# EAGLE schematic RefOsc10MHz_3V0_bga-escaped (EAGLE 7.2.0), part 2 of 2
## Sheet 25 of 27: Socket_3
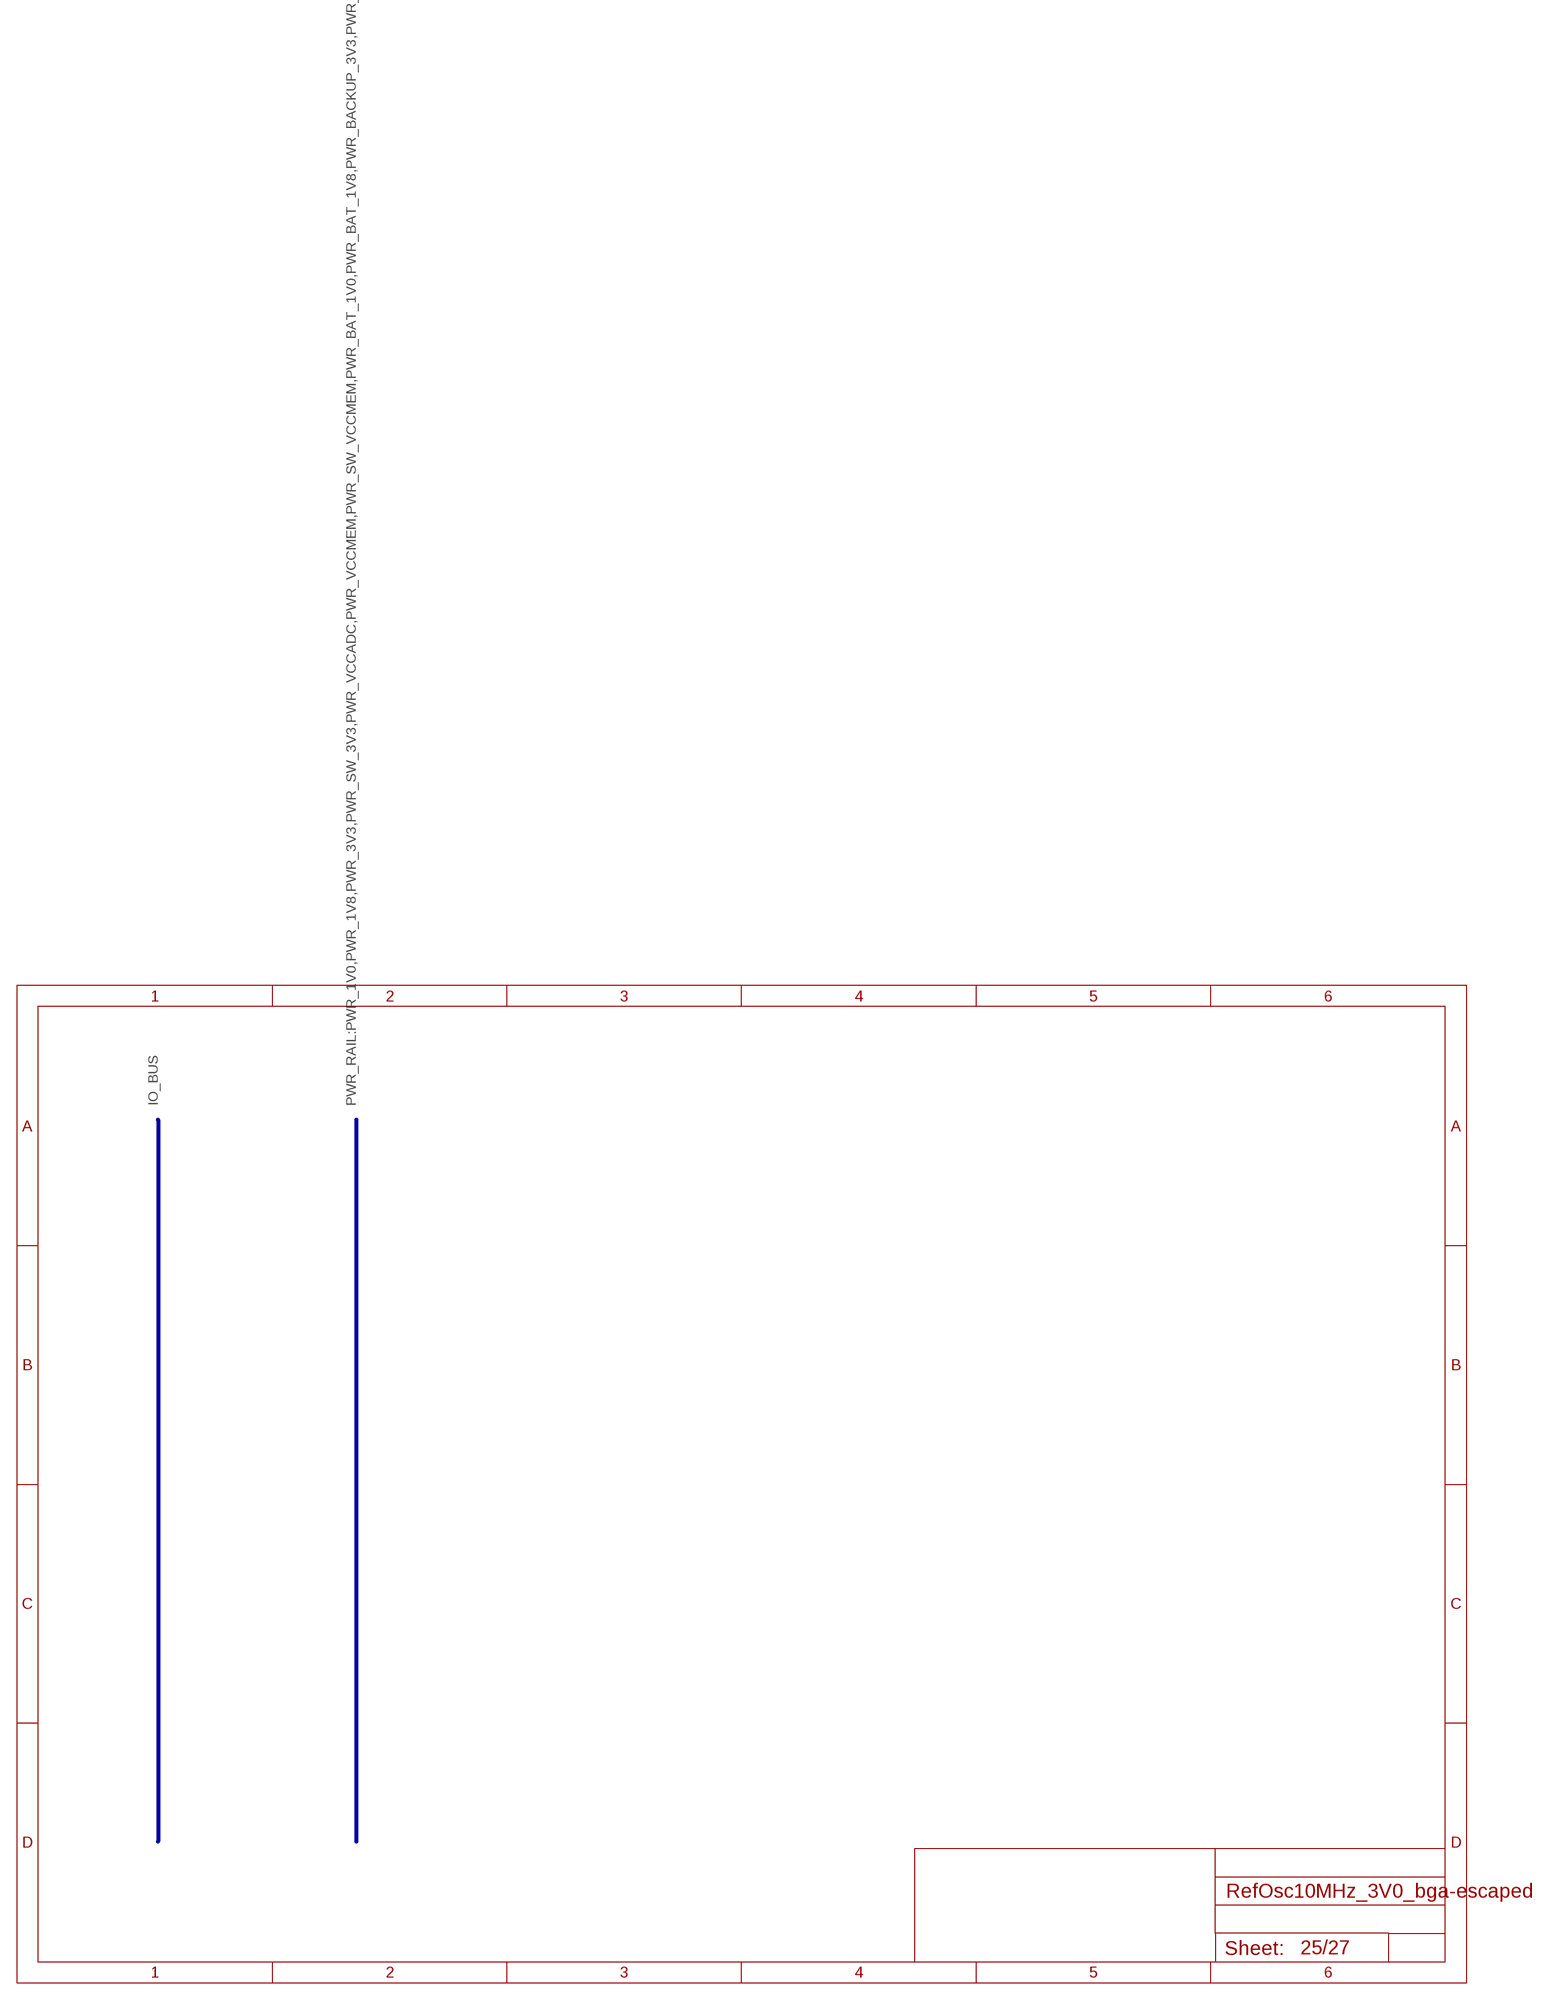
[diagram p24: schematic, sheet 25]

### Buses
IO_BUS
PWR_RAIL:PWR_1V0,PWR_1V8,PWR_3V3,PWR_SW_3V3,PWR_VCCADC,PWR_VCCMEM,PWR_SW_VCCMEM,PWR_BAT_1V0,PWR_BAT_1V8,PWR_BACKUP_3V3,PWR_5V0,PWR_SW_5V0,GND

## Sheet 26 of 27: Socket_4
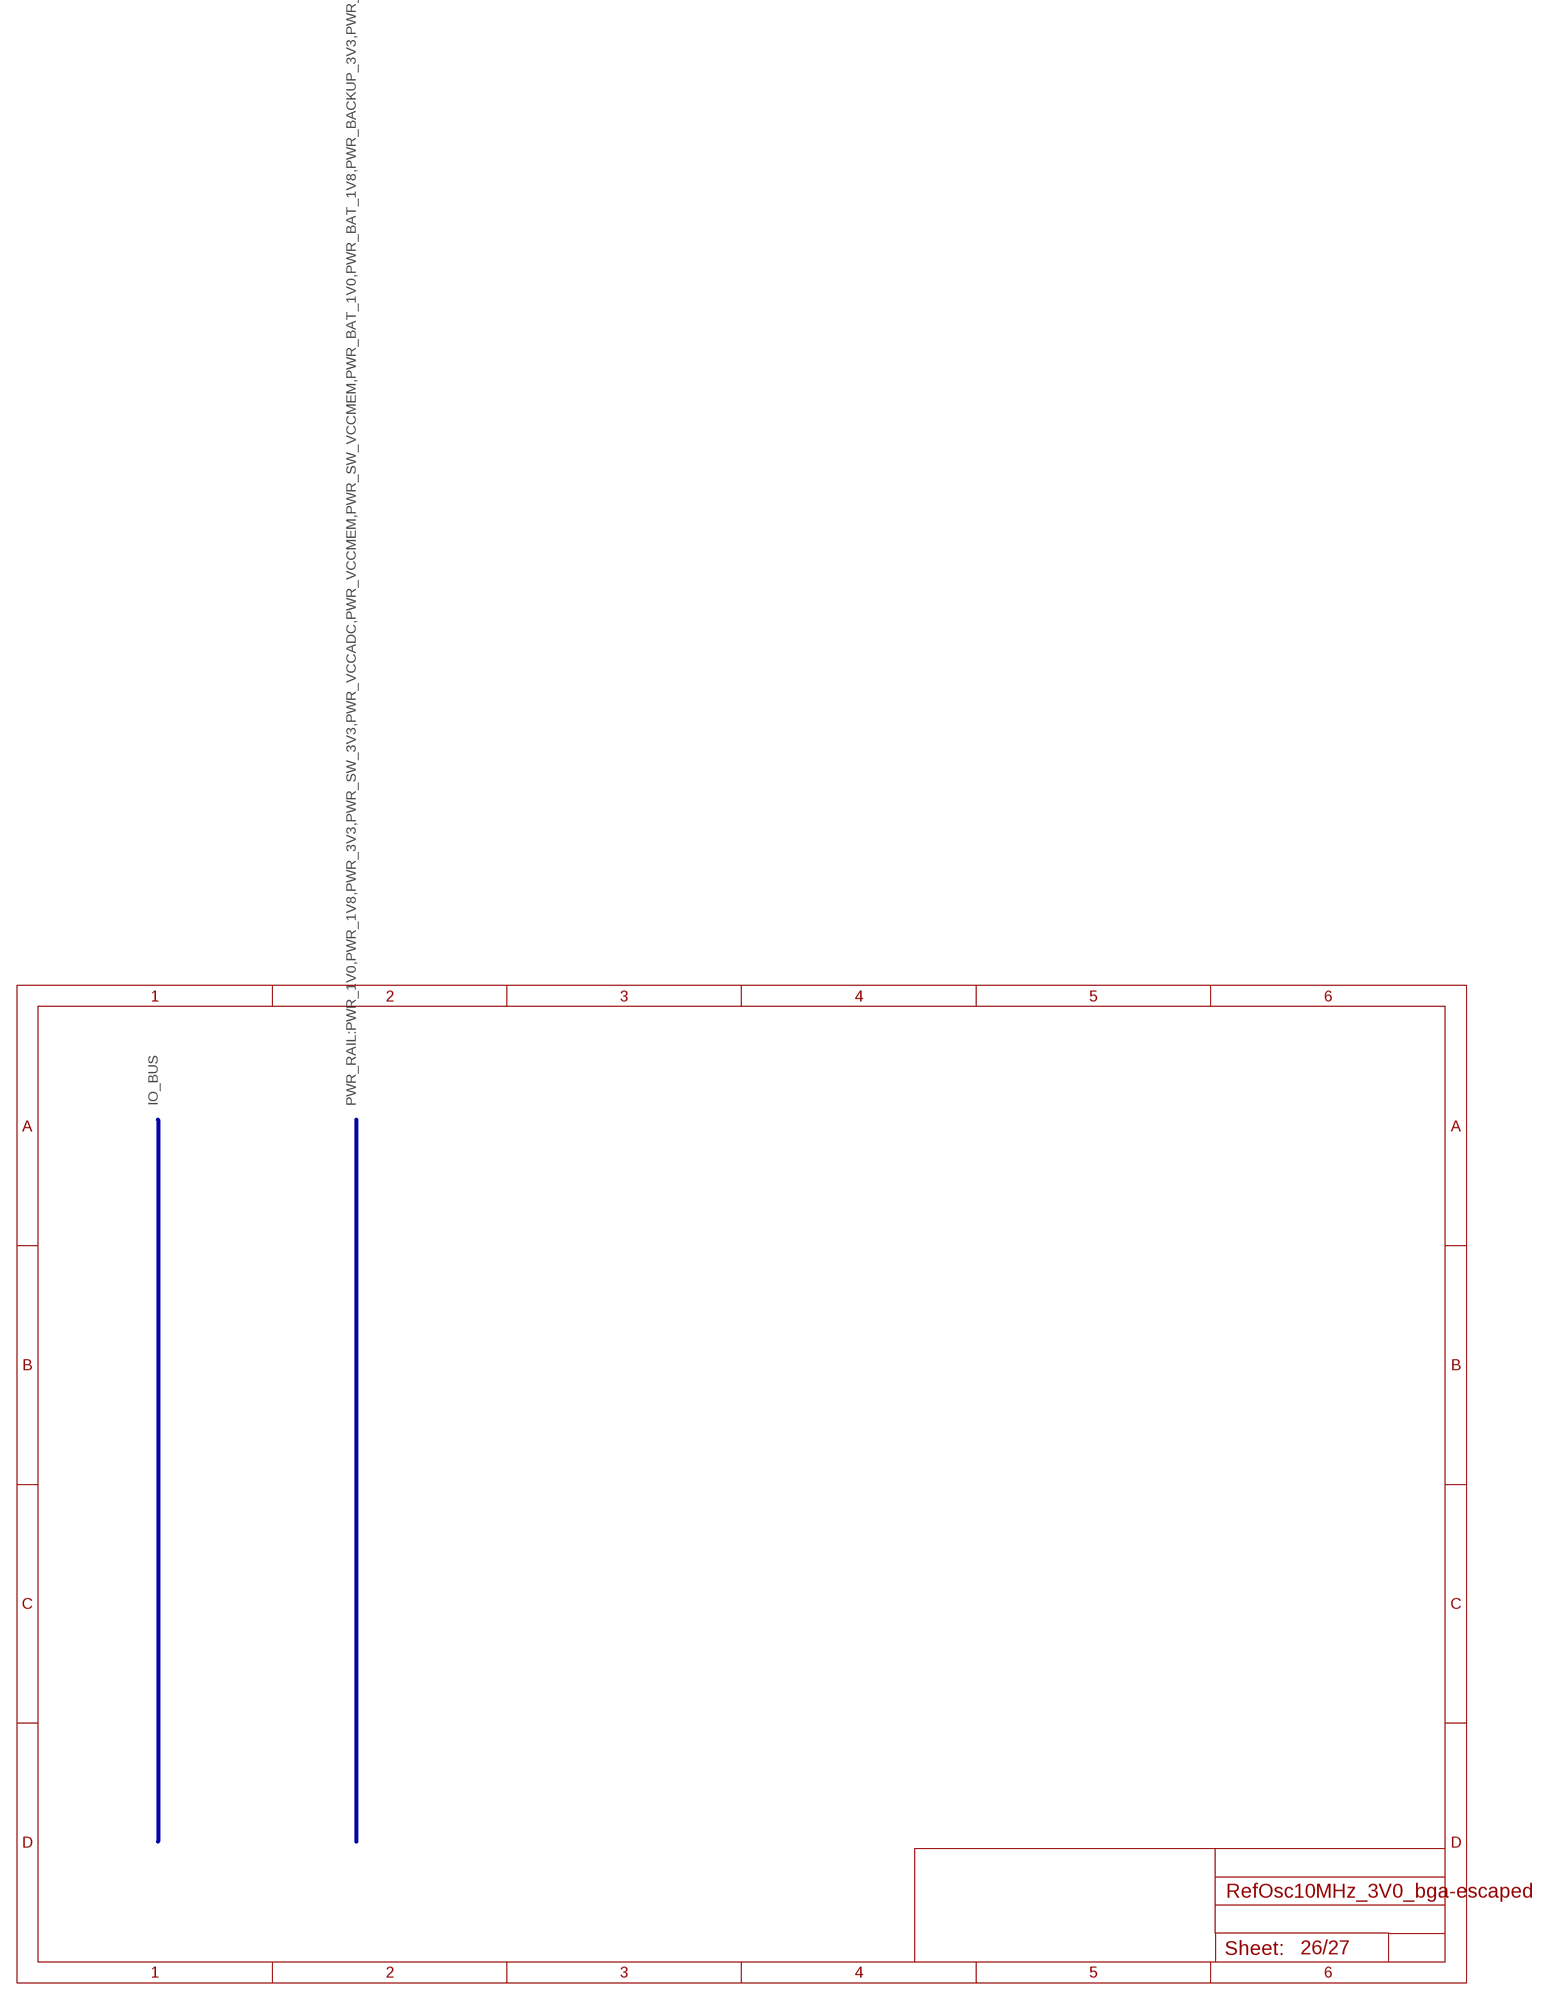
[diagram p25: schematic, sheet 26]

### Buses
IO_BUS
PWR_RAIL:PWR_1V0,PWR_1V8,PWR_3V3,PWR_SW_3V3,PWR_VCCADC,PWR_VCCMEM,PWR_SW_VCCMEM,PWR_BAT_1V0,PWR_BAT_1V8,PWR_BACKUP_3V3,PWR_5V0,PWR_SW_5V0,GND

## Sheet 27 of 27: Socket_5
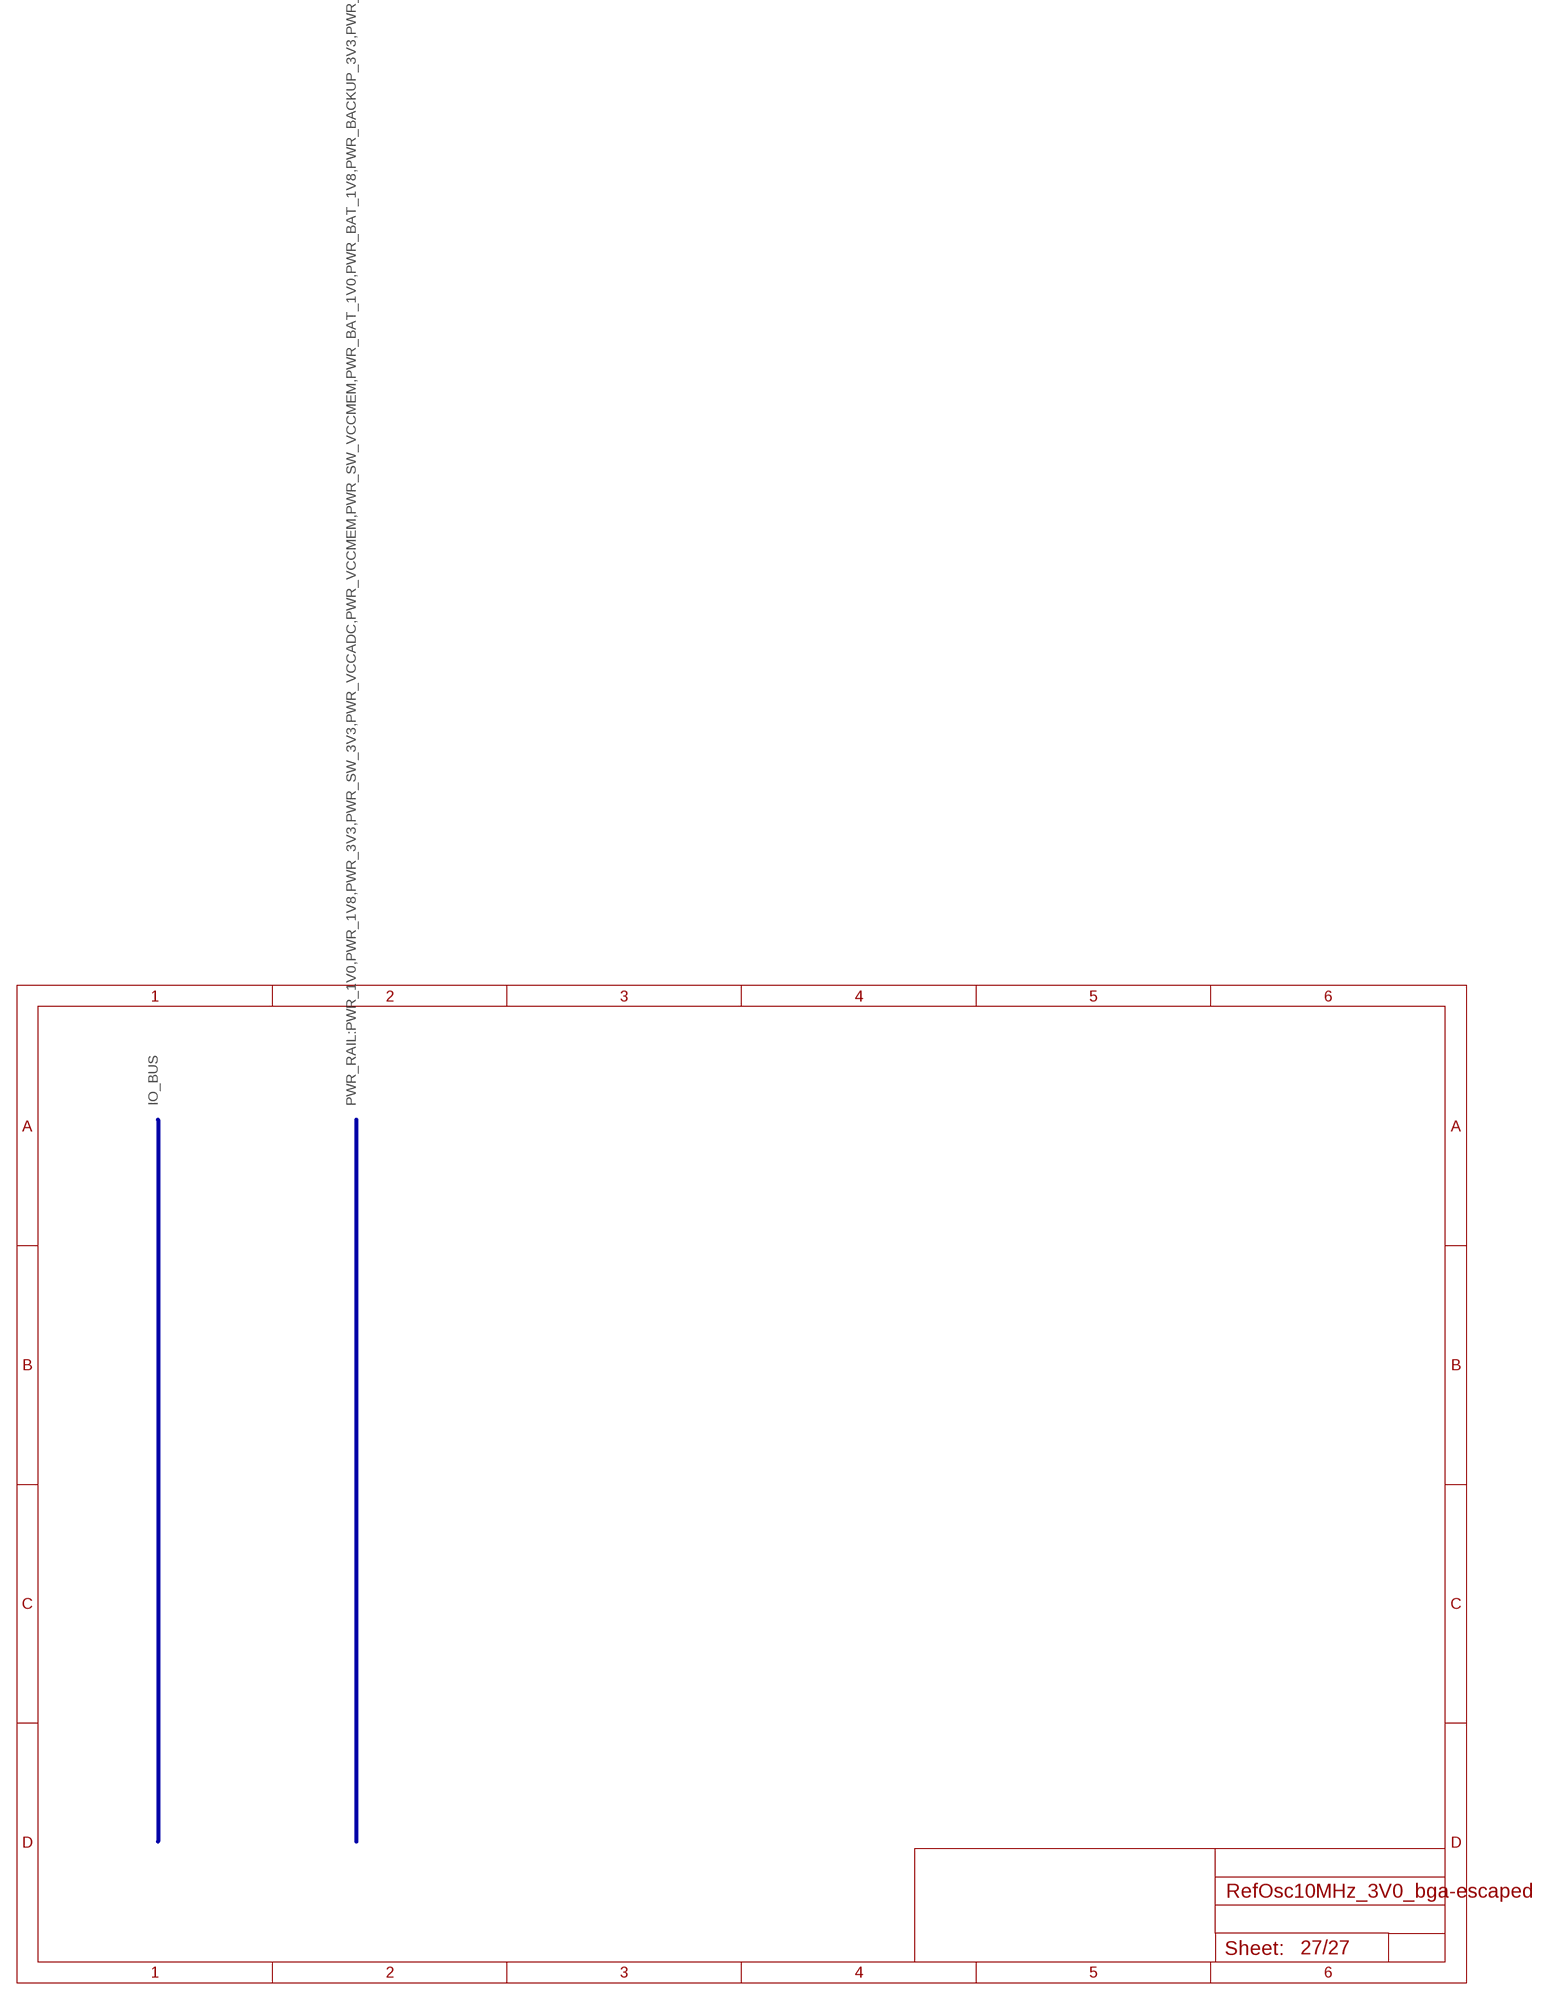
[diagram p26: schematic, sheet 27]

### Buses
IO_BUS
PWR_RAIL:PWR_1V0,PWR_1V8,PWR_3V3,PWR_SW_3V3,PWR_VCCADC,PWR_VCCMEM,PWR_SW_VCCMEM,PWR_BAT_1V0,PWR_BAT_1V8,PWR_BACKUP_3V3,PWR_5V0,PWR_SW_5V0,GND

## Library data of the parts
C031 C032 C051-C057 C062-C067 C071-C073 C082-C087 C091 C092 C141 C142 C0211 C0212 C0221 C0222 C0231 C0232 C0241-C0243 C0251 C0261 C0271 C0272 C0281-C0283 C0291 C0292 C0401 C1001-C1006 C1011 C1012 C1021-C1026 = rcl:C-EU: CAPACITOR, European symbol
C151 = df4iah:C-EU: CAPACITOR, European symbol
C0273 = rcl:CPOL-EU: POLARIZED CAPACITOR, European symbol
CON051 = df4iah:HEADER-2X3: Header 2X3 2.54mm ISP, ...
CON141 = df4iah:TYCO-AMP_USB: TYCO-AMP USB-Connectors From Catalog 7-1773422-0 Issued 03-06; MF: TYCO-AMP; MPN: 1734346; OC_FARNELL: 1321918
CON151 = df4iah_connector:HEADER-2X5: Header 2X5 2.54mm ISP, JTAG, ...
CON181 CON183-CON186 = df4iah:MCX-J-P-X-RA-SM1: FEMALE SMA CONNECTOR Radiall
CON182 = df4iah:MOLEX_BNC-JACK-50R_SD-73100-0105: MOLEX BNC-Jack 50 Ohm SD-73100-0102; MF: MOLEX; MPN: SD-73100-0105; OC_FARNELL: 1909203; OC_NEWARK: -
CON0401 = df4iah:AVR-JTAG-10: AVR JTAG Debug/Programming Header
D031-D033 D141 D142 = diode:BZX84CSMD: Z DIODE
D0271 = diode:ZENER-DIODE: Z-Diode
H191-H194 = holes:MOUNT-PAD-ROUND: MOUNTING PAD, round
L021-L026 = rcl:L-EU: INDUCTOR, European symbol
LED0441 LED0442 = led:LED: LED OSRAM: - CHIPLED LG R971, LG N971, LY N971, LG Q971, LY Q971, LO R971, LY R971 LH N974, LH R974 LS Q976, LO Q976, LY Q976 LO Q996 - Hyper CHIPLED LW Q18S LB Q993, LB Q99A, LB R99A - SideLED LS A670, LO A670, LY A670, LG A670, LP A670 LB A673, LV A673, LT A673, LW A673 LH A674 LY A675 LS A676, LA A676, LO A676, LY A676, LW A676 LS A679, LY A679, LG A679 - Hyper Micro SIDELED® LS Y876, LA Y876, LO Y876, LY Y876 LT Y87S - SmartLED LW L88C, LW L88S LB L89C, LB L89S, LG L890 LS L89K, LO L89K, LY L89K LS L896, LA L896, LO L896, LY L896 - TOPLED LS T670, LO T670, LY T670, LG T670, LP T670 LSG T670, LSP T670, LSY T670, LOP T670, LYG T670 LG T671, LOG T671, LSG T671 LB T673, LV T673, LT T673, LW T673 LH T674 LS T676, LA T676, LO T676, LY T676, LB T676, LH T676, LSB T676, LW T676 LB T67C, LV T67C, LT T67C, LS T67K, LO T67K, LY T67K, LW E67C LS E67B, LA E67B, LO E67B, LY E67B, LB E67C, LV E67C, LT E67C LW T67C LS T679, LY T679, LG T679 LS T770, LO T770, LY T770, LG T770, LP T770 LB T773, LV T773, LT T773, LW T773 LH T774 LS E675, LA E675, LY E675, LS T675 LS T776, LA T776, LO T776, LY T776, LB T776 LHGB T686 LT T68C, LB T68C - Hyper Mini TOPLED® LB M676 - Mini TOPLED Santana® LG M470 LS M47K, LO M47K, LY M47K Source: http://www.osram.convergy.de LUXEON: - LUMILED® LXK2-PW12-R00, LXK2-PW12-S00, LXK2-PW14-U00, LXK2-PW14-V00 LXK2-PM12-R00, LXK2-PM12-S00, LXK2-PM14-U00 LXK2-PE12-Q00, LXK2-PE12-R00, LXK2-PE12-S00, LXK2-PE14-T00, LXK2-PE14-U00 LXK2-PB12-K00, LXK2-PB12-L00, LXK2-PB12-M00, LXK2-PB14-N00, LXK2-PB14-P00, LXK2-PB14-Q00 LXK2-PR12-L00, LXK2-PR12-M00, LXK2-PR14-Q00, LXK2-PR14-R00 LXK2-PD12-Q00, LXK2-PD12-R00, LXK2-PD12-S00 LXK2-PH12-R00, LXK2-PH12-S00 LXK2-PL12-P00, LXK2-PL12-Q00, LXK2-PL12-R00 Source: www.luxeon.com KINGBRIGHT: KA-3528ASYC Source: www.kingbright.com
LP151 = df4iah_rcl:L-EU: INDUCTOR, European symbol
R031 R034 R051 R061 R071 R081 R091 R101-R105 R111-R113 R141-R144 R151 R152 R181-R183 R0271 R0272 R0281-R0285 R0291-R0294 R0299 R0401 R0402 R0411-R0415 R0421 R0431 R0441 R0443 R0451-R0456 RP141 RP151 = rcl:R-EU_: RESISTOR, European symbol
S0401 = smd-special:SWS008: SMD Dip Switch 8 pol.
U021 = df4iah_powersupply:TPS65218: Power Management for ARM® Cortex™-A8/A9 SOCs and FPGA data entry: DF4IAH; OC_DIGIKEY: 296-38610-1-ND; OC_FARNELL: 2471164; OC_MOUSER: 595-TPS65218B1PHPT; OC_NEWARK: 31Y6654; PACKAGE: HTQFP-48; SUPPLIER: TEXAS INSTRUMENTS
U031 = df4iah:CFPT-141: TCXO, 3.0V; MF: IQD-FREQUENCY-PRODUCTS; MPN: LFTVXO022175; OC_FARNELL: 1100745; OC_NEWARK: -
U111 = df4iah_spi-nor-flash:N25Q128A13E: Micron Serial NOR Flash Memory 3V, Multiple I/O, 4KB Sector Erase N25Q128A Source: http://www.micron.com/~/media/documents/products/data-sheet/nor-flash/serial-nor/n25q/n25q_128mb_3v_65nm.pdf; MPN: N25Q128A13ESE40F; OC_AVNET: N25Q128A13ESE40F/BKN; OC_DIGIKEY: 557-1562-ND; OC_FARNELL: 2253682; OC_NEWARK: 53W9418; PACKAGE: SOP2-8; SUPPLIER: Micron
U151 = df4iah_gps:TJ1513MTBD: TJ1513MTBD based on MediaTek MT3333 Many brands like: MediaTek, SkyLab, T.JWL and others GNSS Receiver Module for GPS, QZSS, Galileo and Beidou data entry: 2015-04-08 by DF4IAH.; OC_ALIBABA: TJ1513MTBD; OC_FARNELL: -; OC_NEWARK: -
U181 = df4iah_opamp:OPA357: OPERATIONAL AMPLIFIER WITH SHUTDOWN; MPN: OPA357AIDBVTG4; OC_FARNELL: 1575511; OC_NEWARK: -; PACKAGE: SOT-23-6; SUPPLIER: Texas Instruments
U0401 = df4iah_fpga:XC7A35TFTG256: Xilinx FPGA: XC7A100TFTG256

## Net classes
1 PWR_LOW: width 0.254 mm
2 PWR_MED: width 0.305 mm
3 PWR_HI: width 0.381 mm
4 PAIR_50R: width 1.27 mm, clearance 1.27 mm
5 PAIR_100R: width 0.635 mm, clearance 0.635 mm
6 CLK: clearance 0.635 mm